# EAGLE schematic Guitar Amp (EAGLE 9.6.2)

## Sheet 1 of 2
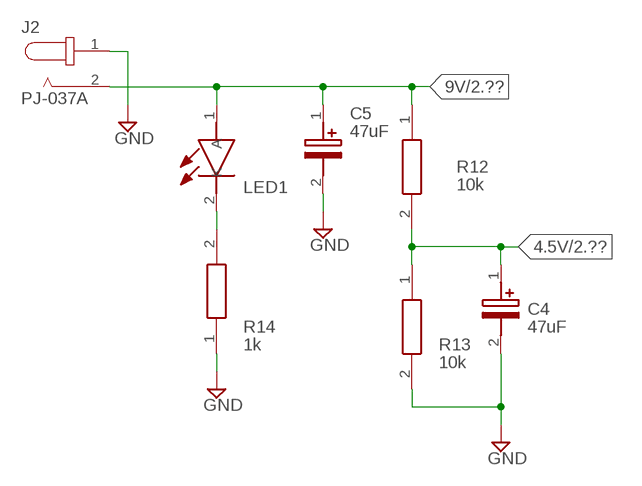
[diagram p0: schematic, sheet 1]

### Parts
C4  47uF  ECA-1CM470  [CAPPRD200W55D500H1200]
C5  47uF  ECA-1CM470  [CAPPRD200W55D500H1200]
J2  PJ-037A  [CUI_PJ-037A]
LED1  TLHR4400-AS12Z  [TLHR4400AS12Z]
R12  10k  MF1_4LCT52R103J  [RESAD1630W60L710D230]
R13  10k  MF1_4LCT52R103J  [RESAD1630W60L710D230]
R14  1k  MF1_4LCT52R103J  [RESAD1630W60L710D230]

### Nets
4.5V: C4.1(+) R12.2 R13.1 ; also sheet 2
9V: C5.1(+) J2.2 LED1.1(A) R12.1 ; also sheet 2
GND: C4.2(-) C5.2(-) J2.1 R13.2 R14.1 ; also sheet 2
N$1: LED1.2(K) R14.2

## Sheet 2 of 2
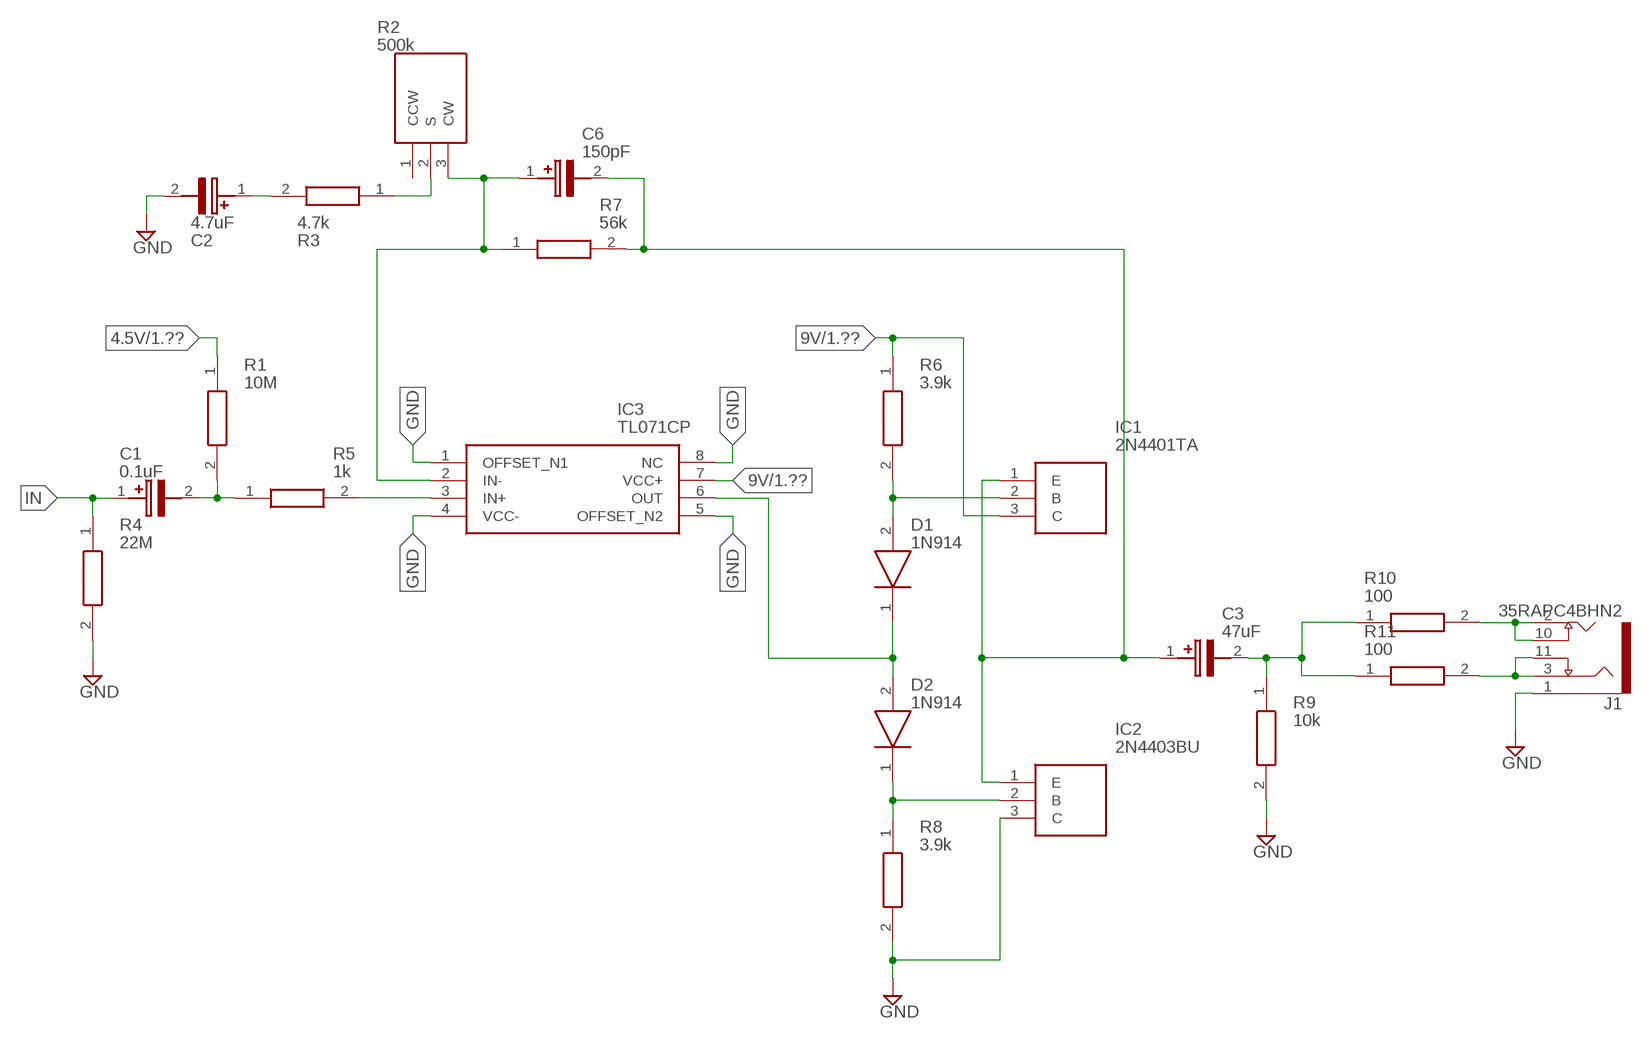
[diagram p1: schematic, sheet 2]

### Parts
C1  0.1uF  ECA-1CM470  [CAPPRD200W55D500H1200]
C2  4.7uF  ECA-1CM470  [CAPPRD200W55D500H1200]
C3  47uF  ECA-1CM470  [CAPPRD200W55D500H1200]
C6  150pF  ECA-1CM470  [CAPPRD200W55D500H1200]
D1  1N914  [DIO_1N914]
D2  1N914  [DIO_1N914]
IC1  2N4401TA  [KA431AZTA]
IC2  2N4403BU  [KA431AZTA]
IC3  TL071CP  [DIP794W53P254L959H508Q8N]
J1  35RAPC4BHN2  [SWITCHCRAFT_35RAPC4BHN2]
R1  10M  MF1_4LCT52R103J  [RESAD1630W60L710D230]
R2  500k  P160KN-0QC15A500K  [P160KN0QD15B1MEG]
R3  4.7k  MF1_4LCT52R103J  [RESAD1630W60L710D230]
R4  22M  MF1_4LCT52R103J  [RESAD1630W60L710D230]
R5  1k  MF1_4LCT52R103J  [RESAD1630W60L710D230]
R6  3.9k  MF1_4LCT52R103J  [RESAD1630W60L710D230]
R7  56k  MF1_4LCT52R103J  [RESAD1630W60L710D230]
R8  3.9k  MF1_4LCT52R103J  [RESAD1630W60L710D230]
R9  10k  MF1_4LCT52R103J  [RESAD1630W60L710D230]
R10  100  MF1_4LCT52R103J  [RESAD1630W60L710D230]
R11  100  MF1_4LCT52R103J  [RESAD1630W60L710D230]

### Nets
4.5V: R1.1 ; also sheet 1
9V: IC1.3(C) IC3.7(VCC+) R6.1 ; also sheet 1
GND: C2.2(-) IC2.3(C) IC3.1(OFFSET_N1) IC3.4(VCC-) IC3.5(OFFSET_N2) IC3.8(NC) J1.1 R4.2 R8.2 R9.2 ; also sheet 1
IN: C1.1(+) R4.1
N$2: C6.1(+) IC3.2(IN-) R2.3(CW) R7.1
N$3: C1.2(-) R1.2 R5.1
N$4: IC3.3(IN+) R5.2
N$5: R2.2(S) R3.1
N$6: C2.1(+) R3.2
N$7: D1.1(K) D2.2(A) IC3.6(OUT)
N$8: D1.2(A) IC1.2(B) R6.2
N$9: D2.1(K) IC2.2(B) R8.1
N$10: C3.1(+) C6.2(-) IC1.1(E) IC2.1(E) R7.2
N$11: C3.2(-) R9.1 R10.1 R11.1
N$12: J1.2 J1.10 R10.2
N$13: J1.3 J1.11 R11.2
Unconnected: R2.1(CCW)

## Library data of the parts
C1-C6 = SamacSys_Parts:ECA-1CM470: Panasonic Aluminium Electrolytic Capacitor 47uF 16V dc 5mm M Series Aluminium, Through Hole Electrolytic, +/-20% Source: Datasheet <https://industrial.panasonic.com/cdbs/www-data/pdf/RDF0000/ABA0000C1218.pdf>; DESCRIPTION: Panasonic Aluminium Electrolytic Capacitor 47uF 16V dc 5mm M Series Aluminium, Through Hole Electrolytic, +/-20%; HEIGHT: 12mm; MANUFACTURER_NAME: Panasonic; MANUFACTURER_PART_NUMBER: ECA-1CM470; MOUSER_PART_NUMBER: 667-ECA-1CM470; MOUSER_PRICE-STOCK: https://www.mouser.co.uk/ProductDetail/Panasonic/ECA-1CM470?qs=IZwnMEax2bpYVJNncOR8yw%3D%3D
D1 D2 = SamacSys_Parts:1N914: Small Signal Diode Source: Datasheet <http://componentsearchengine.com/Datasheets/1/1N914.pdf>; DESCRIPTION: Small Signal Diode; HEIGHT: mm; MANUFACTURER_NAME: ON Semiconductor; MANUFACTURER_PART_NUMBER: 1N914; MOUSER_PART_NUMBER: 512-1N914; MOUSER_PRICE-STOCK: https://www.mouser.co.uk/ProductDetail/ON-Semiconductor-Fairchild/1N914?qs=NSEUUqpg2uCfNuQFcxVZsA%3D%3D
IC1 = SamacSys_Parts:2N4401TA: NPN General Purpose Amplifier Source: Datasheet <https://componentsearchengine.com/Datasheets/2/2N4401TA.pdf>; DESCRIPTION: NPN General Purpose Amplifier; HEIGHT: 5.33mm; MANUFACTURER_NAME: ON Semiconductor; MANUFACTURER_PART_NUMBER: 2N4401TA; MOUSER_PART_NUMBER: 512-2N4401TA; MOUSER_PRICE-STOCK: https://www.mouser.co.uk/ProductDetail/ON-Semiconductor-Fairchild/2N4401TA?qs=TWXTHIu%252B82ksHkuFc6gueQ%3D%3D
IC2 = SamacSys_Parts:2N4403BU: PNP General Purpose Amplifier Source: Datasheet <https://componentsearchengine.com/Datasheets/2/2N4403BU.pdf>; DESCRIPTION: PNP General Purpose Amplifier; HEIGHT: 5.33mm; MANUFACTURER_NAME: ON Semiconductor; MANUFACTURER_PART_NUMBER: 2N4403BU; MOUSER_PART_NUMBER: 512-2N4403BU; MOUSER_PRICE-STOCK: https://www.mouser.co.uk/ProductDetail/ON-Semiconductor-Fairchild/2N4403BU?qs=hXzPkG2nhVb8OEuSUeGhQw%3D%3D
IC3 = SamacSys_Parts:TL071CP: Low-Noise JFET-Input General-Purpose Operational Amplifier Source: Datasheet <http://www.ti.com/lit/ds/symlink/tl071a.pdf>; DESCRIPTION: Low-Noise JFET-Input General-Purpose Operational Amplifier; HEIGHT: 5.08mm; MANUFACTURER_NAME: Texas Instruments; MANUFACTURER_PART_NUMBER: TL071CP; MOUSER_PART_NUMBER: 595-TL071CP; MOUSER_PRICE-STOCK: https://www.mouser.co.uk/ProductDetail/Texas-Instruments/TL071CP?qs=3FVjRv9mUZ%2FN1XJT5coqUQ%3D%3D
J1 = 35RAPC4BHN2:35RAPC4BHN2: Conn 3.5MM Stereo Jack F 5 POS Solder RA Thru-Hole 5 Terminal 1 Port; DESCRIPTION: Conn 3.5MM Stereo Jack F 5 POS Solder RA Thru-Hole 5 Terminal 1 Port; DIGI-KEY_PART_NUMBER: SC1459-ND; DIGI-KEY_PURCHASE_URL: https://www.digikey.com/product-detail/en/switchcraft-inc/35RAPC4BHN2/SC1459-ND/1288690?utm_source=snapeda&utm_medium=aggregator&utm_campaign=symbol; MF: Switchcraft; MP: 35RAPC4BHN2; PACKAGE: None
J2 = PJ-037A:PJ-037A: 2.0 mm Center Pin, 2.5 A, Right Angle, Through Hole, Dc Power Jack Connector Buy Part <https://snapeda.com/parts/PJ-037A/CUI%20Devices/view-part/?ref=eda>; AVAILABILITY: Good; CUI_PURCHASE_URL: https://www.cuidevices.com/product/interconnect/connectors/dc-power-connectors/jacks/pj-037a?utm_source=snapeda.com&utm_medium=referral&utm_campaign=snapedaBOM; DESCRIPTION: 2.0 x 6.5 mm, 2.5 A, Horizontal, Through Hole, Dc Power Jack Connector; DIGIKEY-PURCHASE-URL: https://snapeda.com/shop?store=DigiKey&id=493699; MF: CUI Devices; MOUSER-PURCHASE-URL: https://snapeda.com/shop?store=Mouser&id=493699; MP: PJ-037A; PACKAGE: None; PRICE: None
LED1 = SamacSys_Parts:TLHR4400-AS12Z: Standard LEDs - Through Hole Red 13mcd; 3mm 612-625nm; 2V Typ Source: Datasheet <https://componentsearchengine.com/Datasheets/2/TLHR4400-AS12Z.pdf>; DESCRIPTION: Standard LEDs - Through Hole Red 13mcd; 3mm 612-625nm; 2V Typ; HEIGHT: 6.1mm; MANUFACTURER_NAME: Vishay; MANUFACTURER_PART_NUMBER: TLHR4400-AS12Z; MOUSER_PART_NUMBER: 78-TLHR4400-AS12Z; MOUSER_PRICE-STOCK: https://www.mouser.co.uk/ProductDetail/Vishay-Semiconductors/TLHR4400-AS12Z?qs=nQ9vpdMXC6AwxmxsGskxgg%3D%3D
R1 R3-R14 = SamacSys_Parts:MF1_4LCT52R103J: Metal Film Resistors - Through Hole 1/4 WATT 10K OHM 5% Source: Datasheet <https://componentsearchengine.com/Datasheets/1/MF1_4LCT52R103J.pdf>; DESCRIPTION: Metal Film Resistors - Through Hole 1/4 WATT 10K OHM 5%; HEIGHT: mm; MANUFACTURER_NAME: KOA Speer; MANUFACTURER_PART_NUMBER: MF1/4LCT52R103J; MOUSER_PART_NUMBER: 660-MF1/4LCT52R103J; MOUSER_PRICE-STOCK: https://www.mouser.com/Search/Refine.aspx?Keyword=660-MF1%2F4LCT52R103J
R2 = SamacSys_Parts:P160KN-0QC15A500K: Potentiometers 16mm Rotary Panel Potentiometer Source: Datasheet <https://www.ttelectronics.com/TTElectronics/media/ProductFiles/Potentiometers/Datasheets/P160.pdf>; DESCRIPTION: Potentiometers 16mm Rotary Panel Potentiometer; HEIGHT: 16.5mm; MANUFACTURER_NAME: TT Electronics/BI Magnetics; MANUFACTURER_PART_NUMBER: P160KN-0QC15A500K